# Altium project MC33886_driver_board.PrjPcb
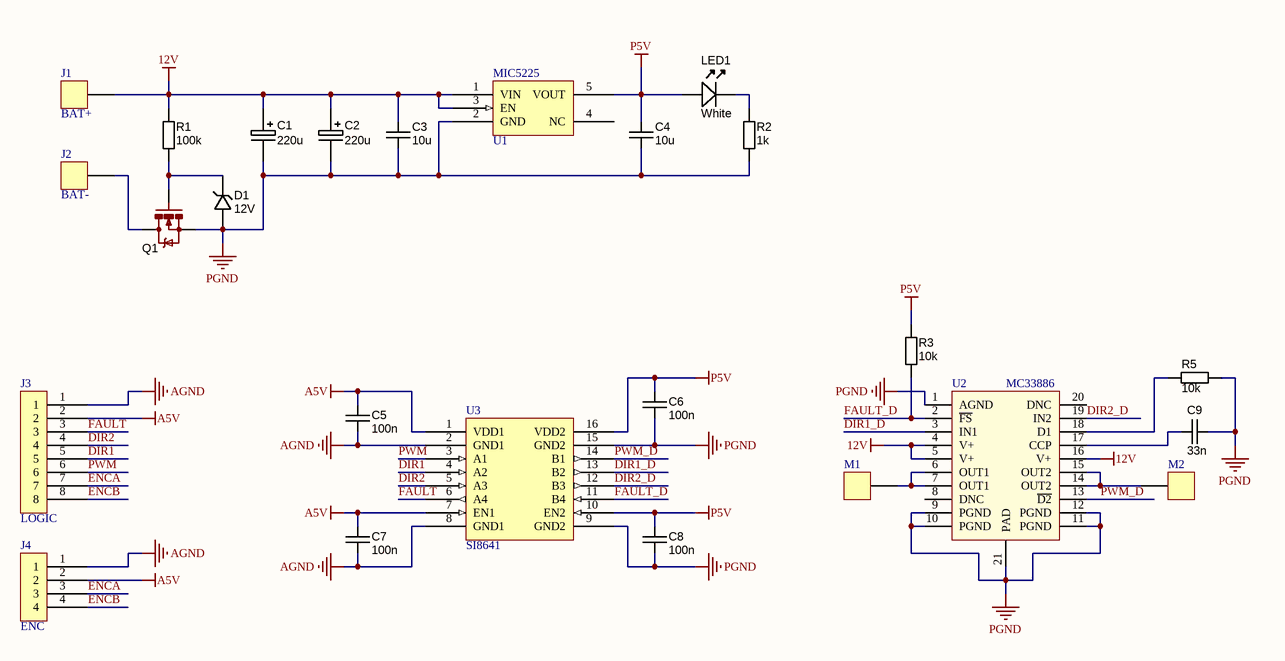
[diagram p0: MC33886_driver_board.SchDoc]
1 sheet, 25 parts. Net scope: global (net labels, ports and power ports of the same name join across sheets).
Board file: MC33886_driver_board.PcbDoc

## Sheet MC33886_driver_board.SchDoc
size A4

### Parts
C1  220u  [CAPE3.5mm]
C2  220u  [CAPE3.5mm]
C3  10u  [CAPC3216X180N]
C4  10u  [CAPC3216X180N]
C5  100n  [CAPC1608X90N]
C6  100n  [CAPC1608X90N]
C7  100n  [CAPC1608X90N]
C8  100n  [CAPC1608X90N]
C9  33n  [CAPC1608X90N]
D1  12V  [SOD123]
J1  BAT+  [POWER-PAD]
J2  BAT-  [POWER-PAD]
J3  LOGIC  [MICRO-MATCH-8]
J4  ENC  [MICRO-MATCH-4]
LED1  White  [LED-0603-GREEN]
M1  HEADER-1  [POWER-PAD]  (value not drawn)
M2  HEADER-1  [POWER-PAD]  (value not drawn)
Q1  MOSFET-N  [SOT669]  (value not drawn)
R1  100k  [RESC1608X55N]
R2  1k  [RESC1608X55N]
R3  10k  [RESC1608X55N]
R5  10k  [RESC1608X55N]
U1  MIC5225  [SOT23-5]
U2  MC33886  [MC33886]
U3  SI8641  [SOIC16]

### Nets
12V: C1.1 C2.1 C3.1 J1.1 R1.1 U1.1(VIN) U1.3(EN) U2.4(V+) U2.5(V+) U2.16(V+)
A5V: C5.2 C7.2 J3.2 J4.2 U3.1(VDD1) U3.7(EN1)
AGND: C5.1 C7.1 J3.1 J4.1 U3.2(GND1) U3.8(GND1)
P5V: C4.1 C6.2 C8.2 LED1.A R3.1 U1.5(VOUT) U3.10(EN2) U3.16(VDD2)
PGND: C1.2 C2.2 C3.2 C4.2 C6.1 C8.1 C9.2 D1.A Q1.S R2.2 R5.2 U1.2(GND) U2.1(AGND) U2.9(PGND) U2.10(PGND) U2.11(PGND) U2.12(PGND) U2.21(PAD) U3.9(GND2) U3.15(GND2)
DIR1: J3.5 U3.4(A2)
DIR1_D: U2.3(IN1) U3.13(B2)
DIR2: J3.4 U3.5(A3)
DIR2_D: U2.19(IN2) U3.12(B3)
ENCA: J3.7 J4.3
ENCB: J3.8 J4.4
FAULT: J3.3 U3.6(A4)
FAULT_D: R3.2 U2.2(~{FS}) U3.11(B4)
PWM: J3.6 U3.3(A1)
PWM_D: U2.13(~{D2}) U3.14(B1)
NetC9_1: C9.1 U2.17(CCP)
NetD1_K: D1.K Q1.G R1.2
NetJ2_1: J2.1 Q1.D
NetLED1_K: LED1.K R2.1
NetM1_1: M1.1 U2.6(OUT1) U2.7(OUT1)
NetM2_1: M2.1 U2.14(OUT2) U2.15(OUT2)
NetR5_1: R5.1 U2.18(D1)

Not connected (* = marked no-connect by the designer): U1 4(NC); U2 8(DNC) 20(DNC)

### Library data of the parts
C1 C2 = CAPE_220u_16V_THD: Capacitor THT Alum Elec 220uF 20% 16V; Manufacturer 1: Nichicon; Manufacturer Part Number 1: UPW1C221MPD; Ratings: 16V; 80°C; Material: Al; Value: 220µ; SCDType: undef; Manufacturer 2: Zhuhai Gree Xinyuan Electric; Manufacturer Part Number 2: CD11C-220-16V; Package / Case: radial 8.0D x 7.0H x 3.5mm pitch; Tolerance: ±20%; Supplier 1: Digi-Key; Supplier Part Number 1: 493-1783-ND
C3 C4 = CAPC_10u_1206_16V: Capacitor SMD Cer 10uF 10% 16V X7R 1206; Manufacturer 1: Kemet; Manufacturer Part Number 1: C1206C106K4RACTU; Ratings: 16V; X7R; Material: ceramic; SCDType: spec; Value: 10µ; Package / Case: 1206 (3216 metric); Tolerance: ±10%; Supplier 1: Digi-Key; Supplier Part Number 1: 399-3525-1-ND
C5-C9 = CAPC_10n_0603_X7R_50V_10%: Capacitor SMD Cer 10nF 10% 50V X7R 0603; Manufacturer 1: TDK Corporation; Manufacturer Part Number 1: C1608X7R1H103K; Ratings: 50V; X7R; Material: ceramic; SCDType: spec; Value: 10n; Package / Case: 0603 (1608 metric); Tolerance: ±10%; Supplier 1: Digi-Key; Supplier Part Number 1: 445-1311-1-ND; ComponentLink1URL: http://product.tdk.com/capacitor/mlcc/en/documents/mlcc_commercial_general_en.pdf; ComponentLink1Description: http://product.tdk.com/capacitor/mlcc/en/documents/mlcc_commercial_general_en.pdf; Supplier 2: Digi-Key; Supplier Part Number 2: 478-1227-1-ND; Manufacturer 2: AVX Corporation; Manufacturer Part Number 2: 06035C103KAT2A; ComponentLink2URL: http://www.avx.com/docs/Catalogs/cx7r.pdf; ComponentLink2Description: http://www.avx.com/docs/Catalogs/cx7r.pdf
D1 = DIODE_ZENER_28V_500mW: Diode Zener SMD 28V 0.5W SOD-123; Manufacturer 1: ON Semiconductor; Manufacturer Part Number 1: MMSZ5255BT1G; Ratings: 28V; 0.5W; Material: Si; Tolerance: ±5%; SCDType: source; Package / Case: SOD-123; Diode Type: Zener; Supplier 1: Digi-Key; Supplier Part Number 1: MMSZ5255BT1GOSCT-ND
J1 J2 = HEADER-1
J3 = HEADER-8
J4 = HEADER-4
LED1 = LED_SMD_Green_0603_570nm: LED 0603 SMD Green 570nm 50mcd 20mA; Manufacturer 1: Kingbright Company LLC; Manufacturer Part Number 1: APT1608CGCK; Material: AlGaInP; Ratings: 20mcd min; 50 mcd typ; 570 nm; Voltage - Forward (Vf) Typ: 2.1V; Viewing Angle: 120°; Lens Style/Size: Rectangle with Flat Top, 1.1mm x 0.8mm; Voltage - Forward (Vf) @ 10mA: 2.0V; SCDType: source; Wavelength - Peak: 574nm; Lens Type: Clear; Package / Case: 0603 (1608 metric); Color: Green; Current - Test: 20mA; Supplier 1: Digi-Key; Supplier Part Number 1: 754-1116-1-ND; RoHS 1: RoHS Compliant; Wavelength - Dominant: 570nm; ComponentLink1URL: http://www.us.kingbright.com/images/catalog/SPEC/APT1608CGCK.pdf; ComponentLink1Description: http://www.us.kingbright.com/images/catalog/SPEC/APT1608CGCK.pdf
Q1 = MOSFET-N: PROD_ID: IC-08089
R1-R3 R5 = RES_1K_0603_1%: Resistor SMD chip 1k Ohm 0.1W 1% 0603; Manufacturer 1: Yageo; Manufacturer Part Number 1: RC0603FR-071KL; Ratings: 1/10W; SCDType: spec; Package / Case: 0603 (1608 Metric); Supplier 1: Digi-Key; Supplier Part Number 1: 311-1.00KHRCT-ND; Tolerance: ±1%; Value: 1K
U1 = LDO-SOT23-5